# Altium schematic sheet V_SYS_Regulator.SchDoc
size A4; SheetNumber: 15; SheetTotal: 21
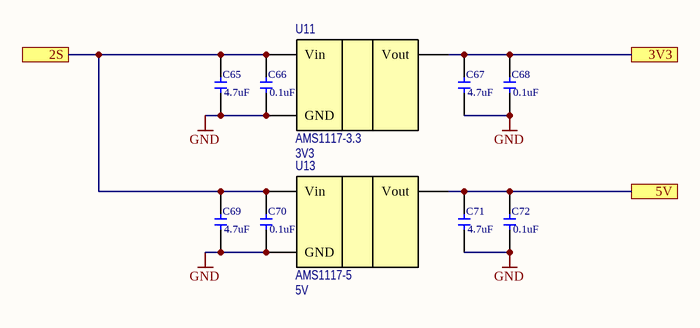
[diagram p0: V_SYS_Regulator.SchDoc]

## Parts
C65  value 4.7uF  [CERCAP 0603]
C66  value 0.1uF  [CERCAP 0402]
C67  value 4.7uF  [CERCAP 0603]
C68  value 0.1uF  [CERCAP 0402]
C69  value 4.7uF  [CERCAP 0603]
C70  value 0.1uF  [CERCAP 0402]
C71  value 4.7uF  [CERCAP 0603]
C72  value 0.1uF  [CERCAP 0402]
U11  AMS1117-3.3  value 3V3  [SOT223]
U13  AMS1117-5  value 5V  [SOT223]

## Ports
2S, 3V3, 5V

## Nets
GND: C65.1 C66.1 C67.1 C68.1 C69.1 C70.1 C71.1 C72.1 U11.ADJ/GND(GND) U13.ADJ/GND(GND)
2S: C65.2 C66.2 C69.2 C70.2 U11.Vin U13.Vin ; port 2S
3V3: C67.2 C68.2 U11.Vout ; port 3V3
5V: C71.2 C72.2 U13.Vout ; port 5V

## Library data of the parts
C65 C67 C69 C71 = !Capacitor: Capacitor; IsSMT: NoSMT; Voltage: 16V; Diel: X7R
C66 C68 C70 C72 = !Capacitor: Capacitor; IsSMT: NoSMT; Voltage: 50V; Diel: X7R
U11 U13 = !Generic LDO: generic ldo; pin to pad: ADJ/GND>1 Vin>3 Vout>2; IsSMT: NoSMT